# Altium project PCB_Project.PrjPcb
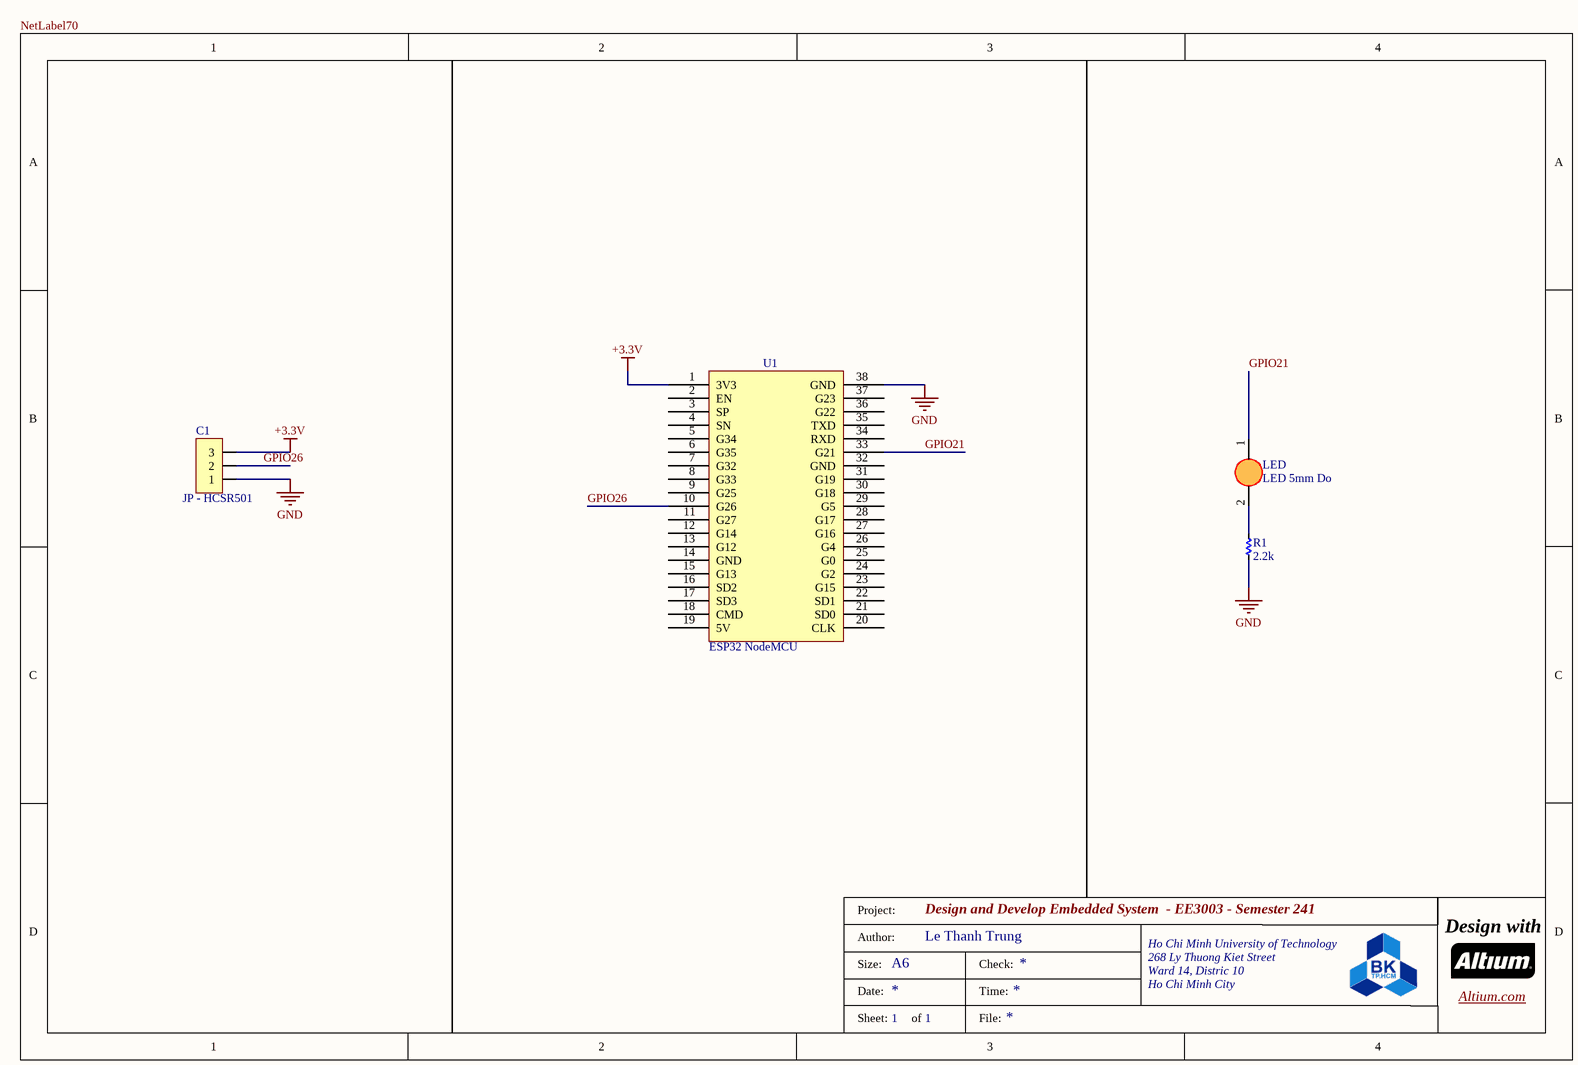
[diagram p0: Sheet1.SchDoc]
1 sheet, 4 parts. Net scope: global (net labels, ports and power ports of the same name join across sheets).
Board file: PCB1.PcbDoc

## Sheet Sheet1.SchDoc
size A4; CheckedBy: Checked; Address1: Ho Chi Minh University of Technology; Address2: 268 Ly Thuong Kiet Street; Address3: Ward 14, Distric 10; Address4: Ho Chi Minh City; SheetNumber: 1; SheetTotal: 1; PageSetup: Record=PageOptions|CenterHorizontal=True|CenterVertical=True|PrintScale=1.00|XCorrection=1.00|YCorrection=1.00|PrintKind=1|BorderSize=5000000|LeftOffset=0|BottomOffset=0|Orientation=2|PaperLength=1000|PaperWidth=1000|Scale=100|PaperSource=7|PrintQuality=-3|MediaType=1|DitherType=10|PrintScaleMode=1|PaperKind=A6|PaperIndex=70; Sheet: 1

### Parts
C1  JP - HCSR501  [JP3-C1T]
LED  LED 5mm Do  [LED 5mm DO]
R1  2.2k  [RES-1W]
U1  ESP32 NodeMCU  [Nodemcu-32s]

### Nets
+3.3V: C1.3 U1.1(3V3)
GND: C1.1 R1.1 U1.38(GND)
GPIO21: LED.1(A) U1.33(G21)
GPIO26: C1.2 U1.10(G26)
NetLED_2: LED.2(K) R1.2

Not connected (* = marked no-connect by the designer): U1 2(EN) 3(SP) 4(SN) 5(G34) 6(G35) 7(G32) 8(G33) 9(G25) 11(G27) 12(G14) 13(G12) 14(GND) 15(G13) 16(SD2) 17(SD3) 18(CMD) 19(5V) 20(CLK) 21(SD0) 22(SD1) 23(G15) 24(G2) 25(G0) 26(G4) 27(G16) 28(G17) 29(G5) 30(G18) 31(G19) 32(GND) 34(RXD) 35(TXD) 36(G22) 37(G23)

### Notes on the sheet
- Labels drawn without touching a wire or pin: NetLabel70, of, Sheet:
- Project:
- Author:
- Le Thanh Trung
- Design and Develop Embedded System  - EE3003 - Semester 241
- Design with
- Size:
- Date:
- A6
- Check:
- Time:
- Altium.com
- File:

### Library data of the parts
C1 = JP3: WR-PHD 2.54 mm Angled Socket Header; Manufacturer: W¨¹rth Elektronik eiSos GmbH; partNo: 613003143121; ComponentLink1 Description: Manufacturer; ComponentLink2 Description: Datasheet; NoPins: 03; Created Date: 29 March 2013; ComponentLink1URL: http://www.we-online.com; ComponentLink2URL: http://katalog.we-online.de/em/datasheet/6130xx143121.pdf; Created by: Karrer Zheng
LED = LED 5mm Do: Cắm; Ten_Linh_Kien: LED 3MM Xanh Lá ( SS); Ma_Hang: MH004935; Don_Vi: Con; Ghi_Chu: *; Kieu_Chan: *; Chung_Loai: Cắm
R1 = Res: Manufacturer: Generic Components; Class: Passive; SubClass: R; Published: 08/06/2000; Publisher: Altium Hobart Technology Centre
U1 = ESP32 NodeMCU: 38 pins